# Altium schematic sheet Mach dieu khien tu xa - Duc Nguyen.SchDoc
size 420 x 297 mm; SheetNumber: 1; SheetTotal: 1
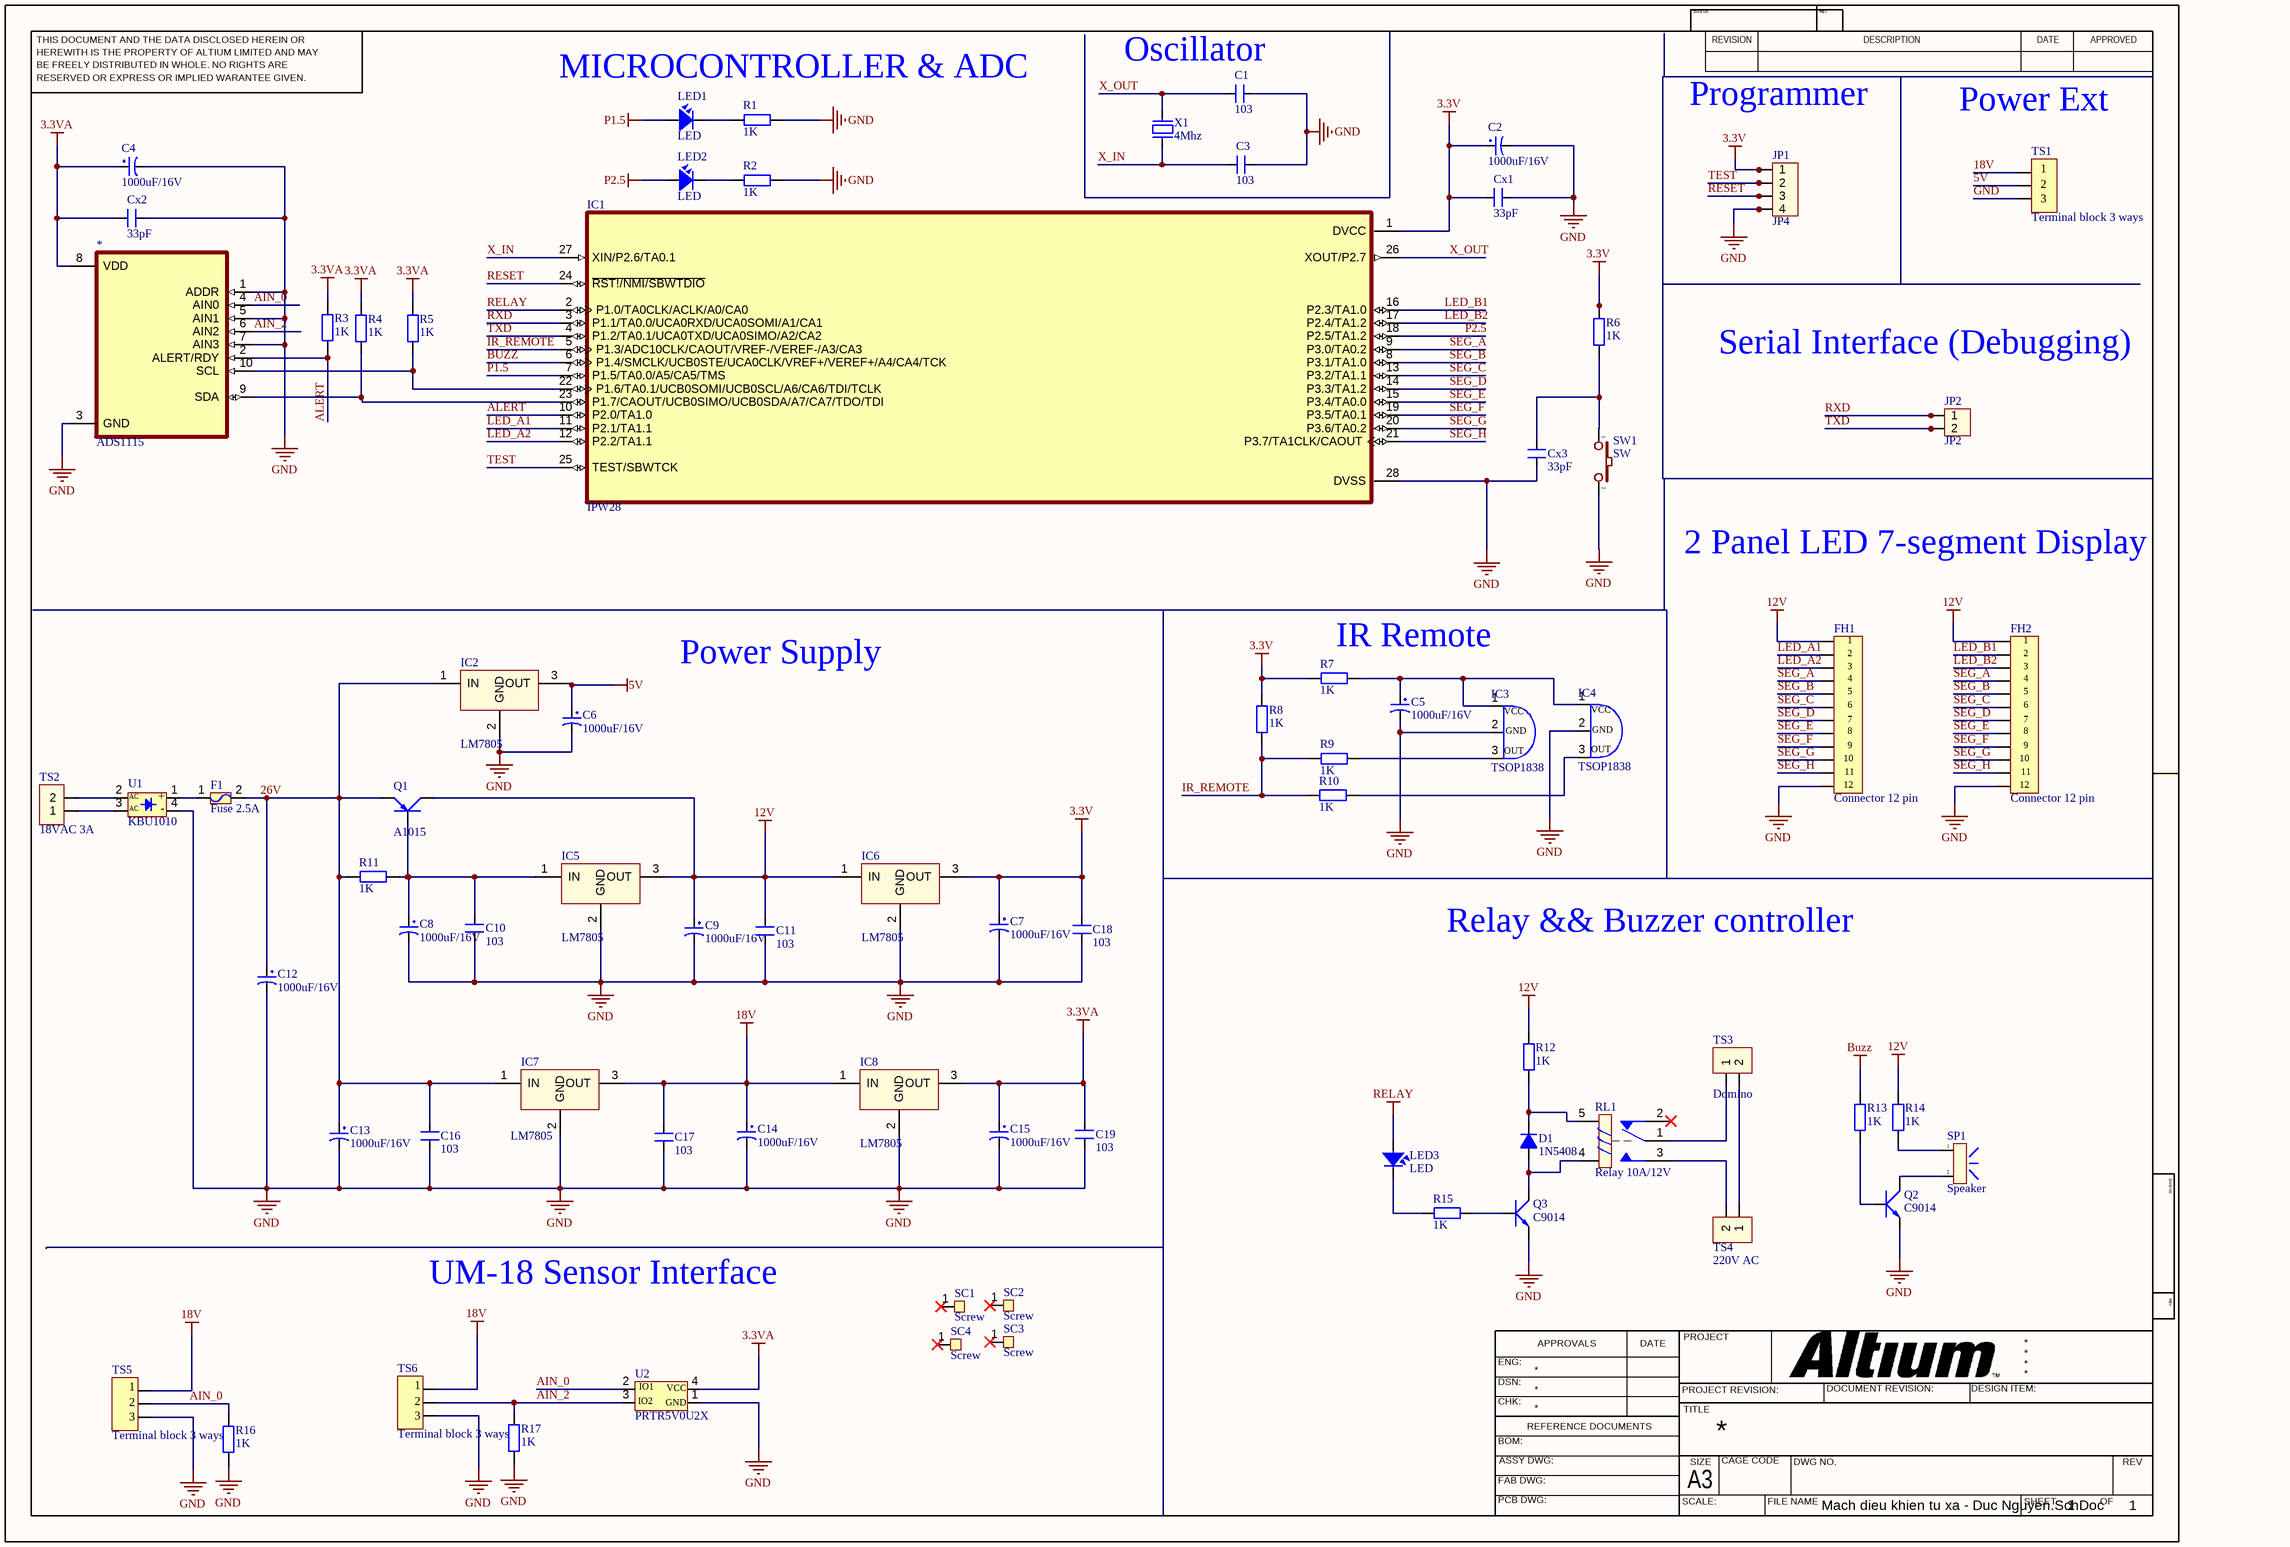
[diagram p0: Mach dieu khien tu xa - Duc Nguyen.SchDoc]

## Parts
*  ADS1115  [ADS1115]
C1  103  [SM-0805]
C2  1000uF/16V  [CP1.5/3.4]
C3  103  [SM-0805]
C4  1000uF/16V  [CP1.5/3.4]
C5  1000uF/16V  [CP1.5/3.4]
C6  1000uF/16V  [CP1.5/3.4]
C7  1000uF/16V  [CP1.5/3.4]
C8  1000uF/16V  [CP1.5/3.4]
C9  1000uF/16V  [CP1.5/3.4]
C10  103  [SM-0805]
C11  103  [SM-0805]
C12  1000uF/16V  [CP1.5/3.4]
C13  1000uF/16V  [CP1.5/3.4]
C14  1000uF/16V  [CP1.5/3.4]
C15  1000uF/16V  [CP1.5/3.4]
C16  103  [SM-0805]
C17  103  [SM-0805]
C18  103  [SM-0805]
C19  103  [SM-0805]
Cx1  33pF  [CN1]
Cx2  33pF  [CN1]
Cx3  33pF  [CN1]
D1  1N5408  [D5A]
F1  Fuse 2.5A  [FUSE2_5A]
FH1  Connector 12 pin  [Female Header 12 pin]
FH2  Connector 12 pin  [Female Header 12 pin]
IC1  IPW28  [MSP430G2553 PW-28 Res]
IC2  LM7805  [QTO-220]
IC3  TSOP1838  [TSOP1838]
IC4  TSOP1838  [TSOP1838]
IC5  LM7805  [QTO-220]
IC6  LM7805  [QTO-220]
IC7  LM7805  [QTO-220]
IC8  LM7805  [QTO-220]
JP1  JP4  [CON4]
JP2  JP2  [CON2]
LED1  LED  [LED-3]
LED2  LED  [LED-3]
LED3  LED  [LED-3]
Q1  A1015  [QTO-92]
Q2  C9014  [QTO-92]
Q3  C9014  [QTO-92]
R1  1K  [SM-0805]
R2  1K  [SM-0805]
R3  1K  [SM-0805]
R4  1K  [SM-0805]
R5  1K  [SM-0805]
R6  1K  [SM-0805]
R7  1K  [SM-0805]
R8  1K  [SM-0805]
R9  1K  [SM-0805]
R10  1K  [SM-0805]
R11  1K  [SM-0805]
R12  1K  [SM-0805]
R13  1K  [SM-0805]
R14  1K  [SM-0805]
R15  1K  [SM-0805]
R16  1K  [SM-0805]
R17  1K  [SM-0805]
RL1  Relay 10A/12V  [RL_SPDT_10A]
SC1  Screw  [Screw 3 small]
SC2  Screw  [Screw 3 small]
SC3  Screw  [Screw 3 small]
SC4  Screw  [Screw 3 small]
SP1  Speaker  [SPK]
SW1  SW  [SW2]
TS1  Terminal block 3 ways  [TERMINAL_SCREW_KF_301_3_Pin]
TS2  18VAC 3A  [Terminal Screw KF301 2pin]
TS3  Domino  [Terminal Screw KF301 2pin]
TS4  220V AC  [Terminal Screw KF301 2pin]
TS5  Terminal block 3 ways  [TERMINAL_SCREW_KF_301_3_Pin]
TS6  Terminal block 3 ways  [TERMINAL_SCREW_KF_301_3_Pin]
U1  KBU1010  [KBU1010G]
U2  PRTR5V0U2X  [PRTR5V0U2X]
X1  4Mhz  [XT2]

## Nets
3.3V: C2.1 C7.1 C18.2 Cx1.1 IC1.1(DVCC) IC6.3(OUT) JP1.1 R6.2 R7.2 R8.2
3.3VA: *.8(VDD) C4.1 C15.1 C19.2 Cx2.1 IC8.3(OUT) R3.2 R4.2 R5.2 U2.4
5V: C6.1 IC2.3(OUT) TS1.2
12V: C9.1 C11.2 FH1.1 FH2.1 IC5.3(OUT) IC6.1(IN) Q1.2(C) R12.2 R14.2
18V: C14.1 C17.2 IC7.3(OUT) IC8.1(IN) TS1.1 TS5.1 TS6.1
BUZZ: IC1.6(P1.4/SMCLK/UCB0STE/UCA0CLK/VREF+/VEREF+/A4/CA4/TCK) R13.2
GND: *.1(ADDR) *.3(GND) *.5(AIN1) *.7(AIN3) C1.2 C2.2 C3.2 C4.2 C5.2 C6.2 C7.2 C8.2 C9.2 C10.1 C11.1 C12.2 C13.2 C14.2 C15.2 C16.1 C17.1 C18.1 C19.1 Cx1.2 Cx2.2 Cx3.1 FH1.12 FH2.12 IC1.28(DVSS) IC2.2(GND) IC3.2 IC4.2 IC5.2(GND) IC6.2(GND) IC7.2(GND) IC8.2(GND) JP1.4 Q2.1(E) Q3.1(E) R1.1 R2.1 R16.1 R17.1 SW1.2 TS1.3 TS5.3 TS6.3 U1.4 U2.1
P1.5: IC1.7(P1.5/TA0.0/A5/CA5/TMS) LED1.1
P2.5: IC1.18(P2.5/TA1.2) LED2.1
RELAY: IC1.2(P1.0/TA0CLK/ACLK/A0/CA0) LED3.1
26V: C12.1 C13.1 C16.2 F1.2 IC2.1(IN) IC7.1(IN) Q1.1(E) R11.2
AIN_0: *.4(AIN0) R16.2 TS5.2 U2.2
AIN_2: *.6(AIN2) R17.2 TS6.2 U2.3
ALERT: *.2(ALERT/RDY) IC1.10(P2.0/TA1.0) R3.1
IR_REMOTE: IC1.5(P1.3/ADC10CLK/CAOUT/VREF-/VEREF-/A3/CA3) R8.1 R9.2 R10.2
LED_A1: FH1.2 IC1.11(P2.1/TA1.1)
LED_A2: FH1.3 IC1.12(P2.2/TA1.1)
LED_B1: FH2.2 IC1.16(P2.3/TA1.0)
LED_B2: FH2.3 IC1.17(P2.4/TA1.2)
RESET: IC1.24(~{RST!/NMI/SBWTDIO}) JP1.3
RXD: IC1.3(P1.1/TA0.0/UCA0RXD/UCA0SOMI/A1/CA1) JP2.1
SEG_A: FH1.4 FH2.4 IC1.9(P3.0/TA0.2)
SEG_B: FH1.5 FH2.5 IC1.8(P3.1/TA1.0)
SEG_C: FH1.6 FH2.6 IC1.13(P3.2/TA1.1)
SEG_D: FH1.7 FH2.7 IC1.14(P3.3/TA1.2)
SEG_E: FH1.8 FH2.8 IC1.15(P3.4/TA0.0)
SEG_F: FH1.9 FH2.9 IC1.19(P3.5/TA0.1)
SEG_G: FH1.10 FH2.10 IC1.20(P3.6/TA0.2)
SEG_H: FH1.11 FH2.11 IC1.21(P3.7/TA1CLK/CAOUT)
TEST: IC1.25(TEST/SBWTCK) JP1.2
TXD: IC1.4(P1.2/TA0.1/UCA0TXD/UCA0SIMO/A2/CA2) JP2.2
X_IN: C3.1 IC1.27(XIN/P2.6/TA0.1) X1.1
X_OUT: C1.1 IC1.26(XOUT/P2.7) X1.2
Net*_9: *.9(SDA) IC1.23(P1.7/CAOUT/UCB0SIMO/UCB0SDA/A7/CA7/TDO/TDI) R4.1
Net*_10: *.10(SCL) IC1.22(P1.6/TA0.1/UCB0SOMI/UCB0SCL/A6/CA6/TDI/TCLK) R5.1
NetC5_1: C5.1 IC3.1 IC4.1 R7.1
NetC8_1: C8.1 C10.2 IC5.1(IN) Q1.3(B) R11.1
NetCx3_2: Cx3.2 R6.1 SW1.1
NetD1_1: D1.1(A) Q3.3(C) RL1.4
NetD1_2: D1.2(K) R12.1 RL1.5
NetF1_1: F1.1 U1.1
NetIC3_3: IC3.3 R9.1
NetIC4_3: IC4.3 R10.1
NetLED1_2: LED1.2 R1.2
NetLED2_2: LED2.2 R2.2
NetLED3_2: LED3.2 R15.1
NetQ2_2: Q2.2(B) R13.1
NetQ2_3: Q2.3(C) SP1.2
NetQ3_2: Q3.2(B) R15.2
NetR14_1: R14.1 SP1.1
NetRL1_1: RL1.1 TS3.1
NetRL1_3: RL1.3 TS4.2
NetTS2_1: TS2.1 U1.3
NetTS2_2: TS2.2 U1.2
NetTS3_2: TS3.2 TS4.1

Not connected (* = marked no-connect by the designer): RL1 2*; SC1 1*; SC2 1*; SC3 1*; SC4 1*

## Notes on the sheet
- MICROCONTROLLER & ADC
- (near C1) Oscillator
- Programmer
- Power Ext
- Serial Interface (Debugging)
- 2 Panel LED 7-segment Display
- Power Supply
- (near R7) IR Remote
- Relay && Buzzer controller
- UM-18 Sensor Interface
- THIS DOCUMENT AND THE DATA DISCLOSED HEREIN OR
- HEREWITH IS THE PROPERTY OF ALTIUM LIMITED AND MAY
- DWG NO:
- REVISION
- REV:
- DESCRIPTION
- DATE
- APPROVED
- BE FREELY DISTRIBUTED IN WHOLE. NO RIGHTS ARE
- RESERVED OR EXPRESS OR IMPLIED WARANTEE GIVEN.
- ENG:
- APPROVALS
- PROJECT
- DSN:
- CHK:
- REFERENCE DOCUMENTS
- PROJECT REVISION:
- TITLE
- DOCUMENT REVISION:
- DESIGN ITEM:
- BOM:
- FAB DWG:
- PCB DWG:
- ASSY DWG:
- SCALE:
- A3
- SIZE
- CAGE CODE
- FILE NAME
- DWG NO.
- SHEET
- OF
- REV
- (in symbol KBU1010) AC; +; -
- (in symbol PRTR5V0U2X) IO1; VCC; IO2; GND
- (in symbol TSOP1838) VCC; GND; OUT

## Library data of the parts
C1 C3 C10 C11 C16-C19 = CM: Cap SMD; Value: 103
C2 C4-C9 C12-C15 = CP4: Cap 1000uF/16V - 220uF/50V; Description 5: 4,7uF>10uF/250V_3,3uF>10uF/400V - 2,2uF>4,7uF/450V; Description 1: 2200uF-3300uF/6,3V - 1000uF-2200uF/10V; Description 2: 1000uF/16V - 470uF => 1000uF/25V - 100uF/100V; Description 3: 330uF>470uF/35V_220uF>470uF/50V_10uF>22uF/250V; Description 4: 220uF => 330uF/63V - 10uF =>33uF/160 - 200V; Value: 1000uF/16V
Cx1-Cx3 = CN0: Cremic For Xtal 1pF => 100pF; Value: 33pF
D1 = D5A: Diode 5A; Value: 1N5408
FH1 FH2 = Female header pin 12 pin
IC1 = MSP430G2553IPW28
IC2 IC5-IC8 = LM78xx: On ap +, from + 5 to + 24VDC; Value: LM7805
JP1 = Con4: Connector 4; Value: Connector 4
JP2 = Con2: Connector 2; Value: Connector 2
LED1-LED3 = LED: LED Single colour Green and Red; Value: LED 3 ly Single Colour
Q1 = A1015: PNP 600mW, ECB; Value: A1015
Q2 Q3 = NPN_EBC: P 600mW, EBC; Value: C9014
R1-R17 = RM: Resistor SMD; Value: 1K
RL1 = Relay 1: Relay SPDT,10A - 12VDC 5 Pin; Value: Relay SPDT, 10A, 12V
SC1-SC4 = screw 3 small
SP1 = SPK: Speaker Chip; Value: Speaker Chip
SW1 = SW2: Switch button 2 pin; Value: SW chip 2 pin
TS1 TS5 TS6 = Terminal Screw 3 Ways
TS2-TS4 = Terminal Screw 2 ways
X1 = XT2: Crystal For all Crystal 2pin.; Value: 4Mhz